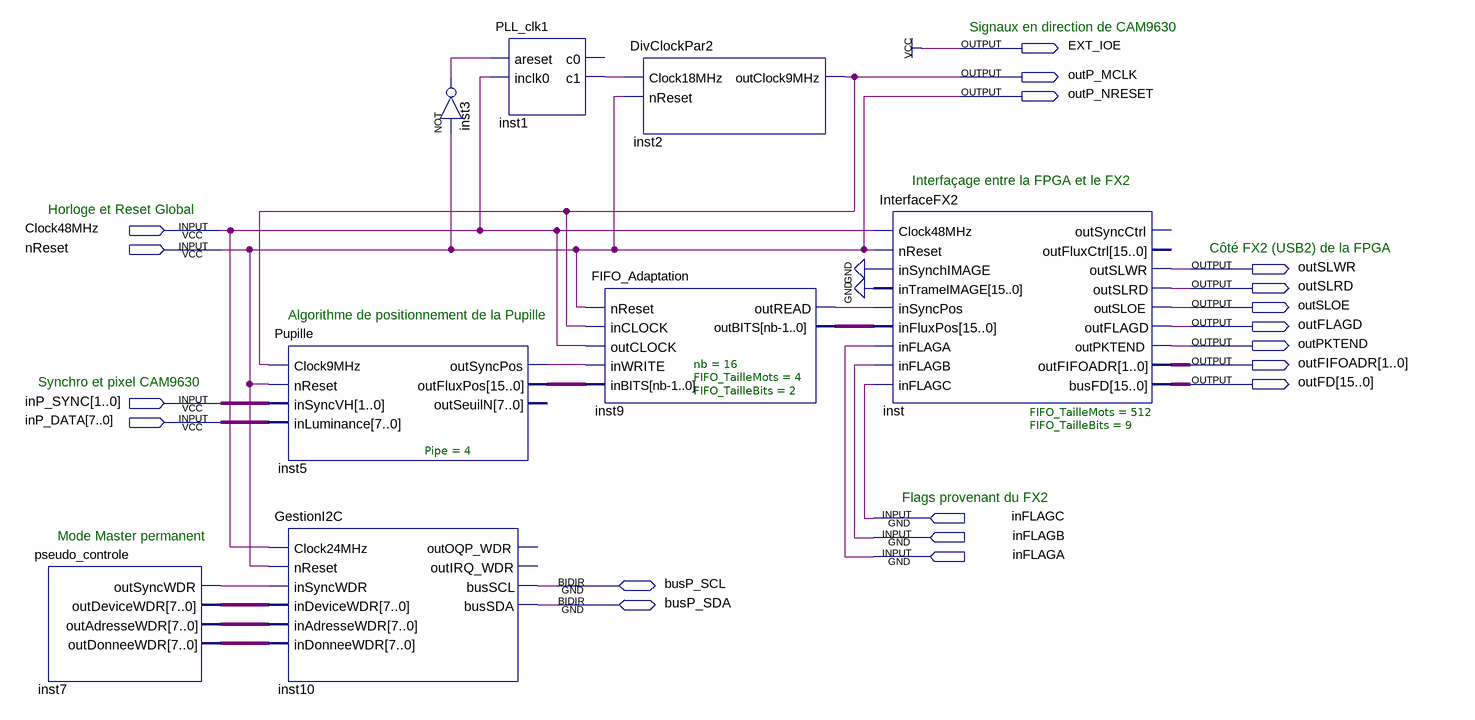
[diagram p0: schematic sheet]
// Quartus schematic VisionStereo_Pupille.bdf as structural Verilog: 8 symbols, 19 pins
module VisionStereo_Pupille (
  input  Clock48MHz,
  input  nReset,
  input  [1:0] inP_SYNC,
  input  [7:0] inP_DATA,
  input  inFLAGC,
  input  inFLAGB,
  input  inFLAGA,
  inout  busP_SCL,
  inout  busP_SDA,
  output EXT_IOE,
  output outP_MCLK,
  output outP_NRESET,
  output outSLWR,
  output outSLRD,
  output outSLOE,
  output outFLAGD,
  output outPKTEND,
  output [1:0] outFIFOADR,
  output [15:0] outFD
);

  wire inst1_c1, inst3_out, inst5_outsyncpos, inst7_outsyncwdr, inst9_outread;
  wire [7:0] inst7_outadressewdr, inst7_outdevicewdr, inst7_outdonneewdr;
  wire [15:0] inst5_outfluxpos, inst9_outbits;

  pseudo_controle inst7 (
    .outSyncWDR(inst7_outsyncwdr), .outDeviceWDR(inst7_outdevicewdr), .outAdresseWDR(inst7_outadressewdr),
    .outDonneeWDR(inst7_outdonneewdr));
  Pupille #(.Pipe(4)) inst5 (
    .Clock9MHz(outP_MCLK), .nReset(nReset), .inSyncVH(inP_SYNC), .inLuminance(inP_DATA),
    .outSyncPos(inst5_outsyncpos), .outFluxPos(inst5_outfluxpos));  // open: outSeuilN
  GestionI2C inst10 (
    .Clock24MHz(Clock48MHz), .nReset(nReset), .inSyncWDR(inst7_outsyncwdr), .inDeviceWDR(inst7_outdevicewdr),
    .inAdresseWDR(inst7_outadressewdr), .inDonneeWDR(inst7_outdonneewdr), .busSCL(busP_SCL), .busSDA(busP_SDA));  // open: outOQP_WDR, outIRQ_WDR
  PLL_clk1 inst1 (.areset(inst3_out), .inclk0(Clock48MHz), .c1(inst1_c1));  // open: c0
  not inst3 (inst3_out, nReset);
  DivClockPar2 inst2 (.Clock18MHz(inst1_c1), .nReset(nReset), .outClock9MHz(outP_MCLK));
  FIFO_Adaptation #(.nb(16), .FIFO_TailleMots(4), .FIFO_TailleBits(2)) inst9 (
    .nReset(nReset), .inCLOCK(outP_MCLK), .outCLOCK(Clock48MHz), .inWRITE(inst5_outsyncpos),
    .inBITS(inst5_outfluxpos), .outREAD(inst9_outread), .outBITS(inst9_outbits));
  InterfaceFX2 #(.FIFO_TailleMots(512), .FIFO_TailleBits(9)) inst (
    .Clock48MHz(Clock48MHz), .nReset(nReset), .inSynchIMAGE(1'b0), .inTrameIMAGE({16{1'b0}}),
    .inSyncPos(inst9_outread), .inFluxPos(inst9_outbits), .inFLAGA(inFLAGA), .inFLAGB(inFLAGB),
    .inFLAGC(inFLAGC), .outSLWR(outSLWR), .outSLRD(outSLRD), .outSLOE(outSLOE), .outFLAGD(outFLAGD),
    .outPKTEND(outPKTEND), .outFIFOADR(outFIFOADR), .busFD(outFD));  // open: outSyncCtrl, outFluxCtrl

  assign EXT_IOE = 1'b1;
  assign outP_NRESET = nReset;

  // Notes on the sheet:
  //   Signaux en direction de CAM9630
  //   Interfaçage entre la FPGA et le FX2
  //   Horloge et Reset Global
  //   Côté FX2 (USB2) de la FPGA
  //   Algorithme de positionnement de la Pupille
  //   Synchro et pixel CAM9630
  //   Flags provenant du FX2
  //   Mode Master permanent
endmodule
